# Altium schematic sheet Buck_converter12_3.3V.SchDoc
size A4; SheetNumber: 5; SheetTotal: 5
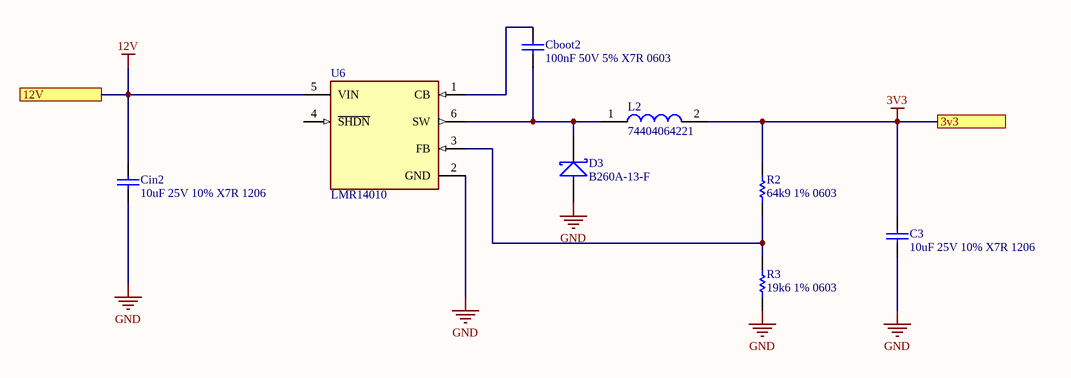
[diagram p0: Buck_converter12_3.3V.SchDoc]

## Parts
C3  10uF 25V 10% X7R 1206  [Cap_Ceramic_1206]
Cboot2  100nF 50V 5% X7R 0603  [Cap_Ceramic_0603]
Cin2  10uF 25V 10% X7R 1206  [Cap_Ceramic_1206]
D3  B260A-13-F  [SMA]
L2  74404064221  [Inductor_6x6mm]
R2  64k9 1% 0603  [Res_ThinFilm_0603]
R3  19k6 1% 0603  [Res_ThinFilm_0603]
U6  LMR14010  [LMR14010]

## Ports
3v3, 12V

## Nets
3V3: C3.2 L2.2 R2.2 ; port 3v3
12V: Cin2.2 U6.5(VIN) ; port 12V
GND: C3.1 Cin2.1 D3.A R3.1 U6.2(GND)
NetCboot2_1: Cboot2.1 D3.K L2.1 U6.6(SW)
NetCboot2_2: Cboot2.2 U6.1(CB)
NetR2_1: R2.1 R3.2 U6.3(FB)

Not connected (* = marked no-connect by the designer): U6 4(~{SHDN})

## Library data of the parts
C3 Cin2 = 10uF 25V 10% X7R 1206: Capacitor, Ceramic, SMD, 10uF, 25V, 10%, X7R, 1206
Cboot2 = 100nF 50V 5% X7R 0603: Capacitor, Ceramic, SMD, 100nF, 50V, 5%, X7R, 0603
D3 = B260A-13-F: Diode, Schottky Barrier Rectifier, 60 V, 2 A, B260A-13-F
L2 = 74404064221: FIXED IND 220UH 660MA 850 MOHM; ComponentLink1Description: Digikey; ComponentLink1URL: https://www.digikey.com.au/product-detail/en/w%C3%BCrth-elektronik/74404064221/732-7261-1-ND/5353241; ComponentLink2Description: LCSC A; ComponentLink2URL: https://lcsc.com/product-detail/Power-Inductors_Sunlord-SWPA6045S221MT_C91047.html; ComponentLink3Description: LCSC B; ComponentLink3URL: https://lcsc.com/product-detail/Power-Inductors_SXN-Shun-Xiang-Nuo-Elec-SMNR6045-221MT_C467145.html
R2 = 64k9 1% 0603: Resistor, SMD, 64k9, 0.1W, 5%, 0603
R3 = 19k6 1% 0603: Resistor, SMD, 19k6, 0.1W, 5%, 0603